# EAGLE design Plasma speaker (EAGLE 8.3.1)
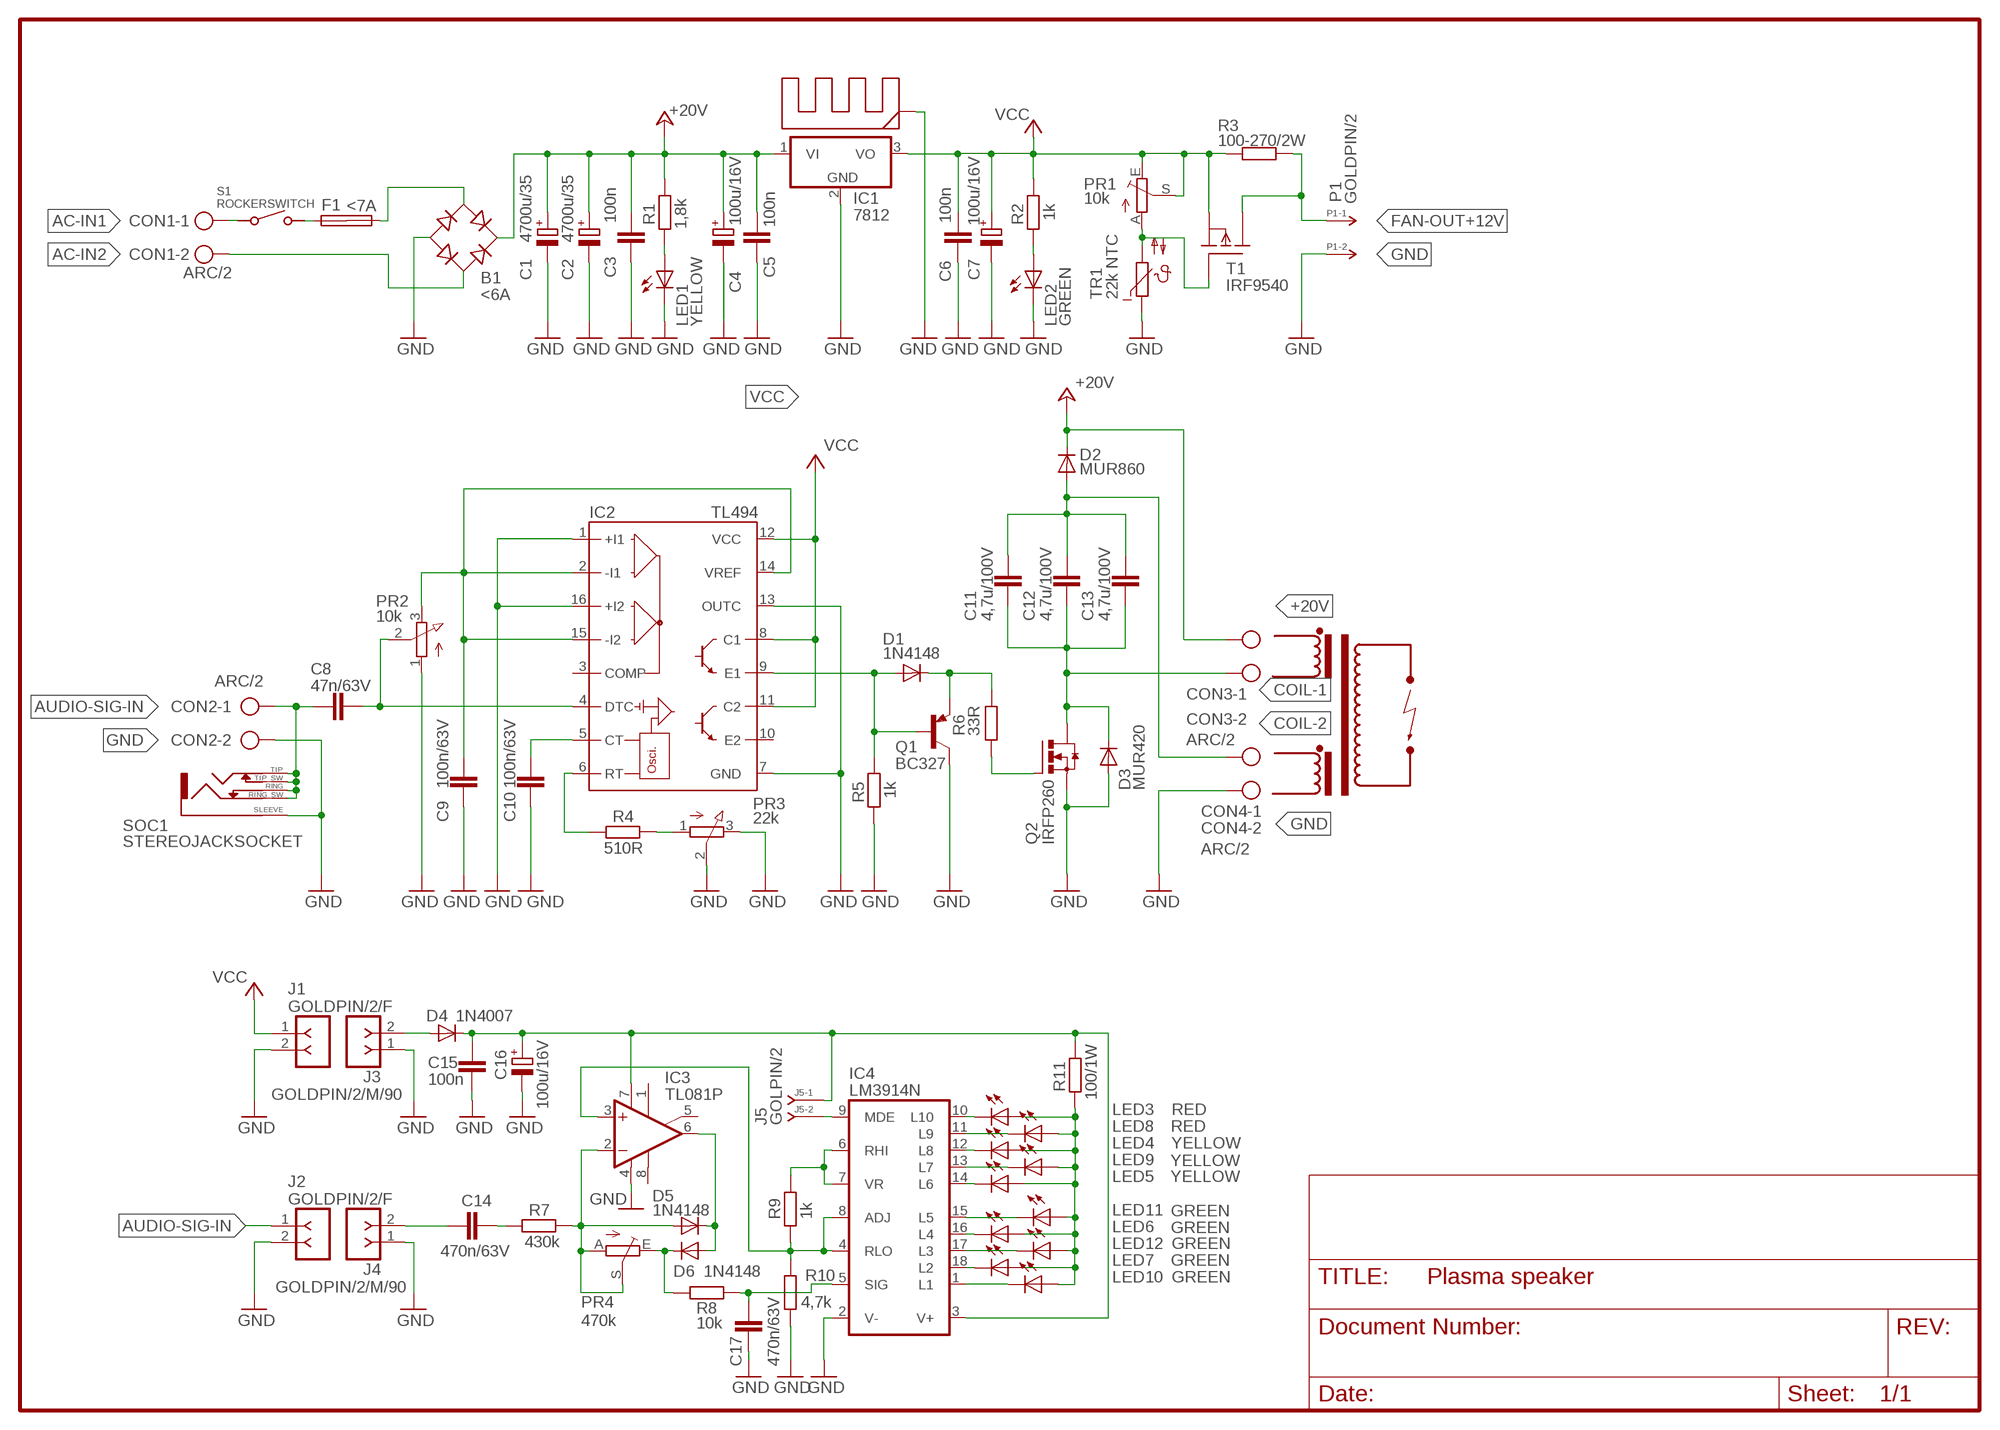
[diagram p0: schematic, sheet 1]

## Parts
B1  <6A  RECTIFIER-SKB32  [SKB32]
C1  4700u/35  CPOL-EUE7.5-18  [E7,5-18]
C2  4700u/35  CPOL-EUE7.5-18  [E7,5-18]
C3  100n  C-EU025-025X050  [C025-025X050]
C4  100u/16V  CPOL-EUE2.5-5  [E2,5-5]
C5  100n  C-EU025-025X050  [C025-025X050]
C6  100n  C-EU025-025X050  [C025-025X050]
C7  100u/16V  CPOL-EUE2.5-5  [E2,5-5]
C8  47n/63V  C-EU050-025X075  [C050-025X075]
C9  100n/63V  C-EU050-025X075  [C050-025X075]
C10  100n/63V  C-EU050-025X075  [C050-025X075]
C11  4,7u/100V  C-EU275-093X316  [C275-093X316]
C12  4,7u/100V  C-EU275-093X316  [C275-093X316]
C13  4,7u/100V  C-EU275-093X316  [C275-093X316]
C14  470n/63V  C-EU050-050X075  [C050-050X075]
C15  100n  C-EU025-025X050  [C025-025X050]
C16  100u/16V  CPOL-EUE2.5-5  [E2,5-5]
C17  470n/63V  C-EU050-050X075  [C050-050X075]
CON1  ARC/2  AK300/2  [AK300/2]
CON2  ARC/2  AK300/2  [AK300/2]
CON3  ARC/2  AK300/2  [AK300/2]
CON4  ARC/2  AK300/2  [AK300/2]
D1  1N4148  1N4148DO35-7  [DO35-7]
D2  MUR860  BYT08P  [TO220ACS]
D3  MUR420  BY203  [SGA-10]
D4  1N4007  1N4004  [DO41-10]
D5  1N4148  1N4148DO35-7  [DO35-7]
D6  1N4148  1N4148DO35-7  [DO35-7]
F1  <7A  SHK20L  [SHK20L]
IC1  7812  7812TV  [TO220V]
IC2  TL494  TL494CN  [DIL16]
IC3  TL081P  [DIL08]
IC4  LM3914N  [DIL18]
J1  GOLDPIN/2/F  F-1X02-SIP-100-40Y  [SIP-100-02-40Y]
J2  GOLDPIN/2/F  F-1X02-SIP-100-40Y  [SIP-100-02-40Y]
J3  GOLDPIN/2/M/90  F-1X02-KK-4455-A02  [KK-4455-A02]
J4  GOLDPIN/2/M/90  F-1X02-KK-4455-A02  [KK-4455-A02]
J5  GOLPIN/2  J-02-SIP-100-40Y  [SIP-100-02-40Y]
LED1  YELLOW  LED5MM  [LED5MM]
LED2  GREEN  LED5MM  [LED5MM]
LED3  RED  LED5MM  [LED5MM]
LED4  YELLOW  LED5MM  [LED5MM]
LED5  YELLOW  LED5MM  [LED5MM]
LED6  GREEN  LED5MM  [LED5MM]
LED7  GREEN  LED5MM  [LED5MM]
LED8  RED  LED5MM  [LED5MM]
LED9  YELLOW  LED5MM  [LED5MM]
LED10  GREEN  LED5MM  [LED5MM]
LED11  GREEN  LED5MM  [LED5MM]
LED12  GREEN  LED5MM  [LED5MM]
P1  GOLDPIN/2  P-02-SIP-100-40Y  [SIP-100-02-40Y]
PR1  10k  TRIM_EU-CA6V  [CA6V]
PR2  10k  3RP/1610N  [3RP/1610N]
PR3  22k  3RP/1610N  [3RP/1610N]
PR4  470k  TRIM_EU-CA6V  [CA6V]
Q1  BC327  BC327-25-PNP-TO92-EBC  [TO92-EBC]
Q2  IRFP260  IRFP240  [TO247BV]
R1  1,8k  R-EU_0204/7  [0204/7]
R2  1k  R-EU_0204/7  [0204/7]
R3  100-270/2W  R-EU_0309/12  [0309/12]
R4  510R  R-EU_0204/7  [0204/7]
R5  1k  R-EU_0204/7  [0204/7]
R6  33R  R-EU_0207/10  [0207/10]
R7  430k  R-EU_0204/7  [0204/7]
R8  10k  R-EU_0204/7  [0204/7]
R9  1k  R-EU_0204/7  [0204/7]
R10  4,7k  R-EU_0204/7  [0204/7]
R11  100/1W  R-EU_0411/15  [0411/15]
RAD1  TO3  RADIATOR-A  [RADIATOR]
S1  ROCKERSWITCH  [ROCKER]
SOC1  STEREOJACKSOCKET  PICAXE_STEREOJACKSOCKET  [PICAXE_STEREOJACKSOCKET]
T1  IRF9540  IRF9530  [TO220]
TR1  22k NTC  NTC640  [P640]

## Nets
+20V: B1.+ C1.+ C2.+ C3.1 C4.+ C5.1 CON3.1 D2.C IC1.1(VI) R1.1
AC-IN1: CON1.1 S1.IN1(IN) S1.IN2(IN)
AC-IN2: B1.AC2 CON1.2
AUDIO-SIG-IN: C8.2 CON2.1 J2.1 SOC1.RING SOC1.RING_SW(RING-SW) SOC1.TIP SOC1.TIP_SW(TIP-SW)
COIL-1: C11.2 C12.2 C13.2 CON3.2 D3.C Q2.D
COIL-2: C11.1 C12.1 C13.1 CON4.1 D2.A
FAN-OUT+12V: P1.1 R3.2 T1.2(D)
GND: B1.- C1.- C2.- C3.2 C4.- C5.2 C6.2 C7.- C9.2 C10.2 C15.2 C16.- C17.1 CON2.2 CON4.2 D3.A IC1.2(GND) IC2.1(+I1) IC2.7(GND) IC2.13(OUTC) IC2.16(+I2) IC3.4(V-) IC4.2(V-) J1.2 J2.2 J3.1 J4.1 LED1.K(C) LED2.K(C) P1.2 PR2.1(A) PR3.2(S) PR3.3(E) Q1.C Q2.S R5.1 R10.2 RAD1.GND SOC1.SLEEVE TR1.1
N$1: B1.AC1 F1.2A
N$2: C14.1 J4.2
N$3: C8.1 IC2.4(DTC) PR2.2(S)
N$4: Q2.G R6.1
N$5: PR1.A T1.1(G) TR1.2
N$6: D1.A IC2.9(E1) Q1.B R5.2
N$7: D4.A J3.2
N$8: IC4.10(L10) LED3.K(C)
N$9: C10.1 IC2.5(CT)
N$11: IC2.6(RT) R4.2
N$12: PR3.1(A) R4.1
N$13: D1.C Q1.E R6.2
N$15: F1.1A S1.OUT
N$16: LED2.A R2.2
N$18: LED1.A R1.2
N$19: C9.1 IC2.2(-I1) IC2.14(VREF) IC2.15(-I2) PR2.3(E)
N$20: IC4.11(L9) LED8.K(C)
N$21: IC4.12(L8) LED4.K(C)
N$22: IC4.13(L7) LED9.K(C)
N$23: IC4.14(L6) LED5.K(C)
N$24: IC4.1(L1) LED10.K(C)
N$25: IC4.18(L2) LED7.K(C)
N$26: IC4.17(L3) LED12.K(C)
N$27: IC4.16(L4) LED6.K(C)
N$28: IC4.15(L5) LED11.K(C)
N$29: LED3.A LED4.A LED5.A LED6.A LED7.A LED8.A LED9.A LED10.A LED11.A LED12.A R11.1
N$30: IC3.3(+IN) IC4.4(RLO) IC4.8(ADJ) R9.2 R10.1
N$31: D5.A IC3.2(-IN) PR4.A PR4.S R7.1
N$32: IC4.6(RHI) IC4.7(VR) R9.1
N$34: C14.2 R7.2
N$38: D5.C D6.A IC3.6(OUT)
N$39: IC4.9(MDE) J5.2
N$40: D6.C PR4.E R8.2
N$42: C17.2 IC4.5(SIG) R8.1
V+: C15.1 C16.+ D4.C IC3.7(V+) IC4.3(V+) J5.1 R11.2
VCC: C6.1 C7.+ IC1.3(VO) IC2.8(C1) IC2.11(C2) IC2.12(VCC) J1.1 PR1.E PR1.S R2.1 R3.1 T1.3(S)
Unconnected: F1.1B F1.2B IC2.3(COMP) IC2.10(E2) IC3.1(ON1) IC3.5(ON2) IC3.8(OPT)

## Library data of the parts
B1 = rectifier:RECTIFIER-: Rectifier
C1 C2 C4 C7 C16 = rcl:CPOL-EU: POLARIZED CAPACITOR, European symbol
C3 C5 C6 C8-C15 C17 = rcl:C-EU: CAPACITOR, European symbol
CON1-CON4 = con-ptr500:AK300/2: CONNECTOR; OC_FARNELL: unknown; OC_NEWARK: unknown
D1 D5 D6 = diode:1N4148: DIODE high speed (Philips)
D2 = diode:BYT08P: DIODE ultra fast
D3 = diode:BY203: DIODE Si, 2 kV, 0.25 A, 300 ns
D4 = diode:1N4004: DIODE general purpose rectifier, 1 A
F1 = fuse:SHK20L: FUSE HOLDER 5 x 20 mm, SH contact, SHH1 Schukat, E1073 Buerklin; OC_FARNELL: unknown; OC_NEWARK: unknown
IC1 = linear:78*: Positive VOLTAGE REGULATOR Source: http://cache.national.com/ds/LM/LM78L05.pdf http://www.fairchildsemi.com/ds/LM/LM7805.pdf
IC2 = linear:TL494*: SWITCHMODE Pulse Width Modulation Control Circuit NCV494B http://onsemi.com tl494-d.pdf
IC3 = linear:TL081: OP AMP
IC4 = linear:LM3914N: LED DRIVER senses analog voltage levels and drives 10 LEDs
J1-J4 = con-headers-jp:F-1X02-: FEMALE HEADER
J5 = con-headers-jp:J-02-: HEADER JACK PINS
LED1-LED12 = led:LED: LED OSRAM: - CHIPLED LG R971, LG N971, LY N971, LG Q971, LY Q971, LO R971, LY R971 LH N974, LH R974 LS Q976, LO Q976, LY Q976 LO Q996 - Hyper CHIPLED LW Q18S LB Q993, LB Q99A, LB R99A - SideLED LS A670, LO A670, LY A670, LG A670, LP A670 LB A673, LV A673, LT A673, LW A673 LH A674 LY A675 LS A676, LA A676, LO A676, LY A676, LW A676 LS A679, LY A679, LG A679 - Hyper Micro SIDELED® LS Y876, LA Y876, LO Y876, LY Y876 LT Y87S - SmartLED LW L88C, LW L88S LB L89C, LB L89S, LG L890 LS L89K, LO L89K, LY L89K LS L896, LA L896, LO L896, LY L896 - TOPLED LS T670, LO T670, LY T670, LG T670, LP T670 LSG T670, LSP T670, LSY T670, LOP T670, LYG T670 LG T671, LOG T671, LSG T671 LB T673, LV T673, LT T673, LW T673 LH T674 LS T676, LA T676, LO T676, LY T676, LB T676, LH T676, LSB T676, LW T676 LB T67C, LV T67C, LT T67C, LS T67K, LO T67K, LY T67K, LW E67C LS E67B, LA E67B, LO E67B, LY E67B, LB E67C, LV E67C, LT E67C LW T67C LS T679, LY T679, LG T679 LS T770, LO T770, LY T770, LG T770, LP T770 LB T773, LV T773, LT T773, LW T773 LH T774 LS E675, LA E675, LY E675, LS T675 LS T776, LA T776, LO T776, LY T776, LB T776 LHGB T686 LT T68C, LB T68C - Hyper Mini TOPLED® LB M676 - Mini TOPLED Santana® LG M470 LS M47K, LO M47K, LY M47K Source: http://www.osram.convergy.de LUXEON: - LUMILED® LXK2-PW12-R00, LXK2-PW12-S00, LXK2-PW14-U00, LXK2-PW14-V00 LXK2-PM12-R00, LXK2-PM12-S00, LXK2-PM14-U00 LXK2-PE12-Q00, LXK2-PE12-R00, LXK2-PE12-S00, LXK2-PE14-T00, LXK2-PE14-U00 LXK2-PB12-K00, LXK2-PB12-L00, LXK2-PB12-M00, LXK2-PB14-N00, LXK2-PB14-P00, LXK2-PB14-Q00 LXK2-PR12-L00, LXK2-PR12-M00, LXK2-PR14-Q00, LXK2-PR14-R00 LXK2-PD12-Q00, LXK2-PD12-R00, LXK2-PD12-S00 LXK2-PH12-R00, LXK2-PH12-S00 LXK2-PL12-P00, LXK2-PL12-Q00, LXK2-PL12-R00 Source: www.luxeon.com KINGBRIGHT: KA-3528ASYC Source: www.kingbright.com
P1 = con-headers-jp:P-02-: HEADER PLUG PINS
PR1 PR4 = pot:TRIM_EU-: POTENTIOMETER
PR2 PR3 = pot:3RP/1610N: 16mm Potentiometer one level Source: http://www.alphapotentiometers.net/html/16mm_pot_2.html
Q1 = transistor:*-PNP-: PNP Transistror
Q2 = transistor-power:IRFP240: HEXFET Power MosFet Source: http://www.irf.com/
R1-R11 = rcl:R-EU_: RESISTOR, European symbol
RAD1 = M-SOUND:RADIATOR
S1 = Rocker Switch:ROCKERSWITCH
SOC1 = PICAXE_StereoJackSocket:PICAXE_STEREOJACKSOCKET
T1 = transistor-fet:IRF9530: P-Channel Enhancement MOSFET (HEXFET); -100V; -12A; 0,3Ohm
TR1 = ptc-ntc:NTC640: PHILIPS NTC; OC_FARNELL: unknown; OC_NEWARK: unknown

## Board
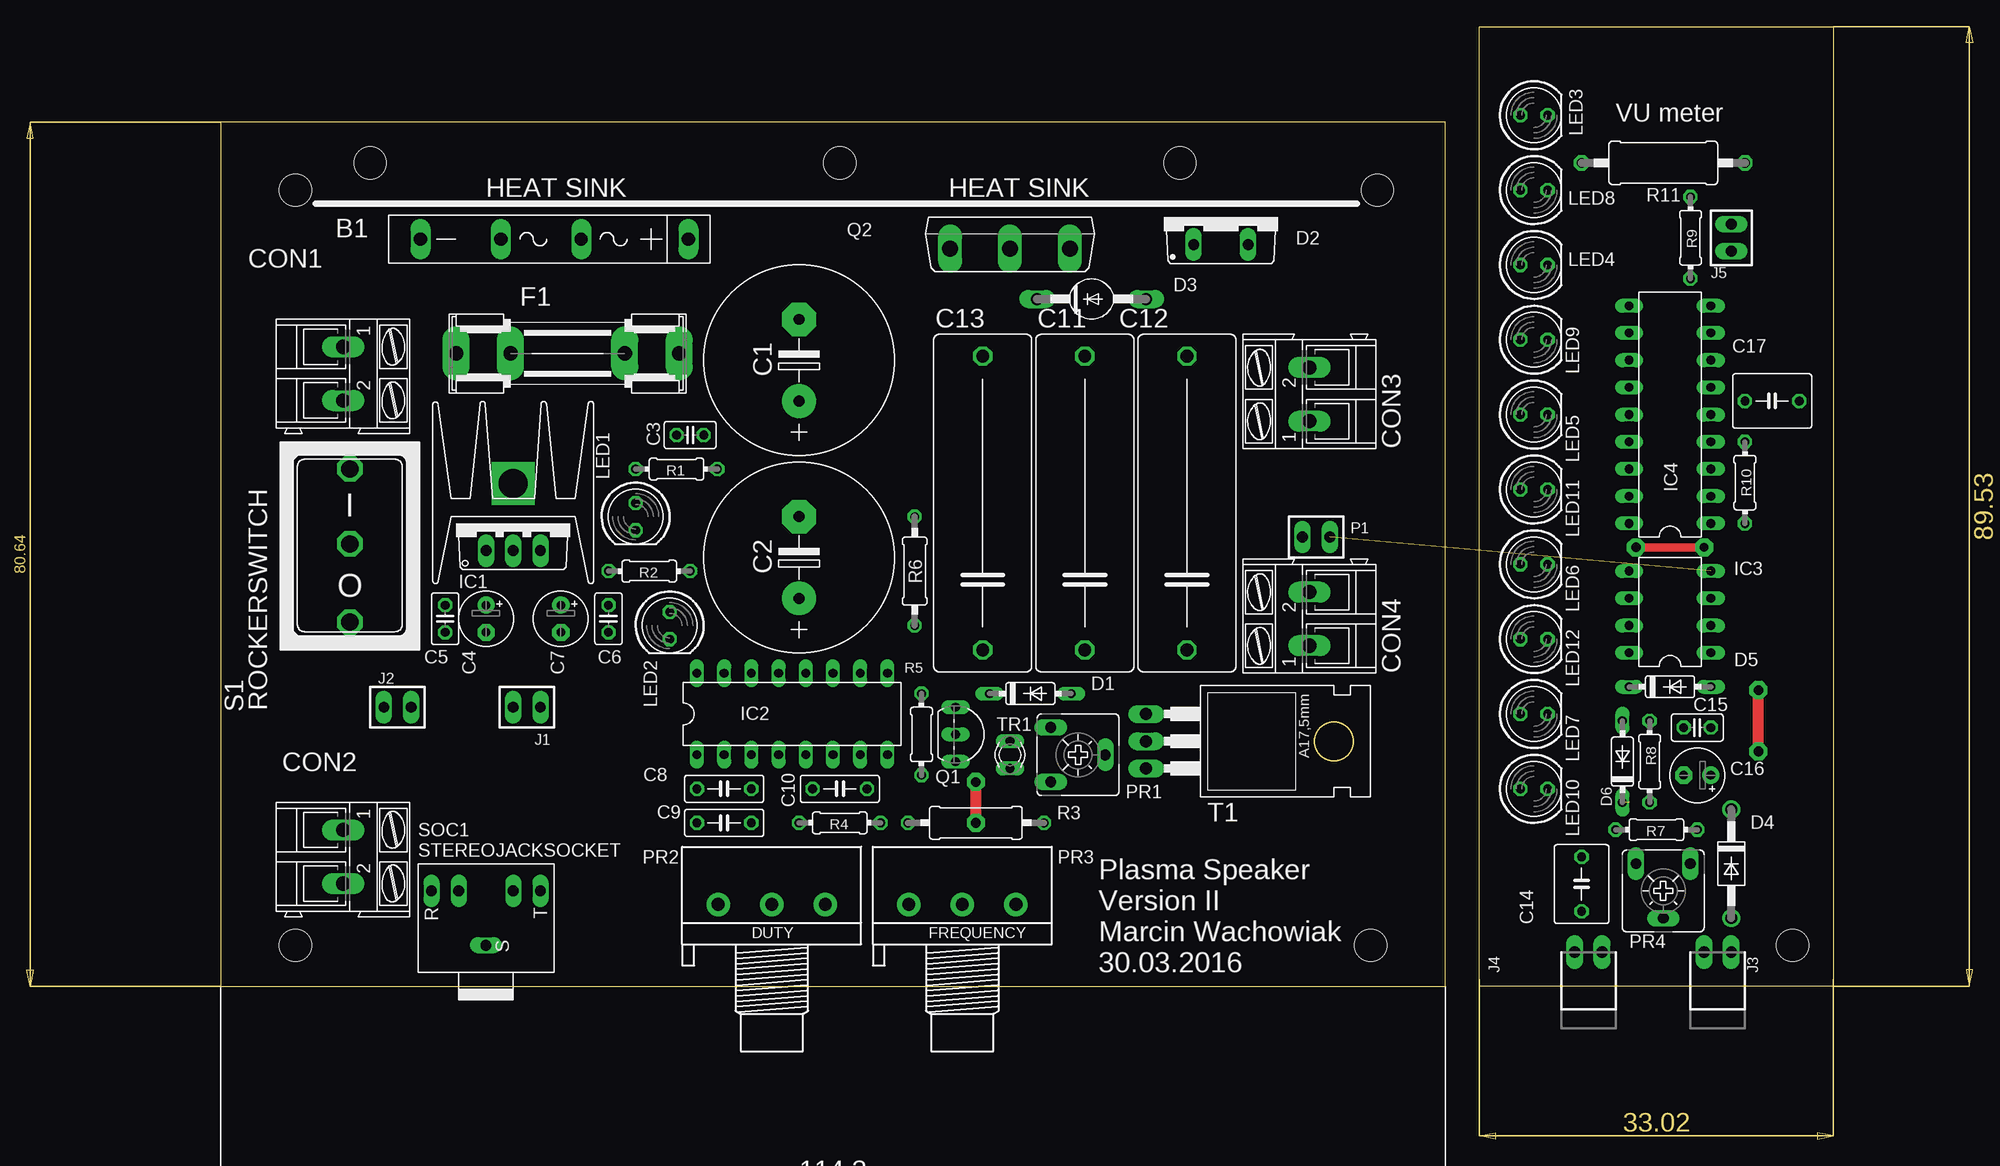
[diagram p1: board, top side]
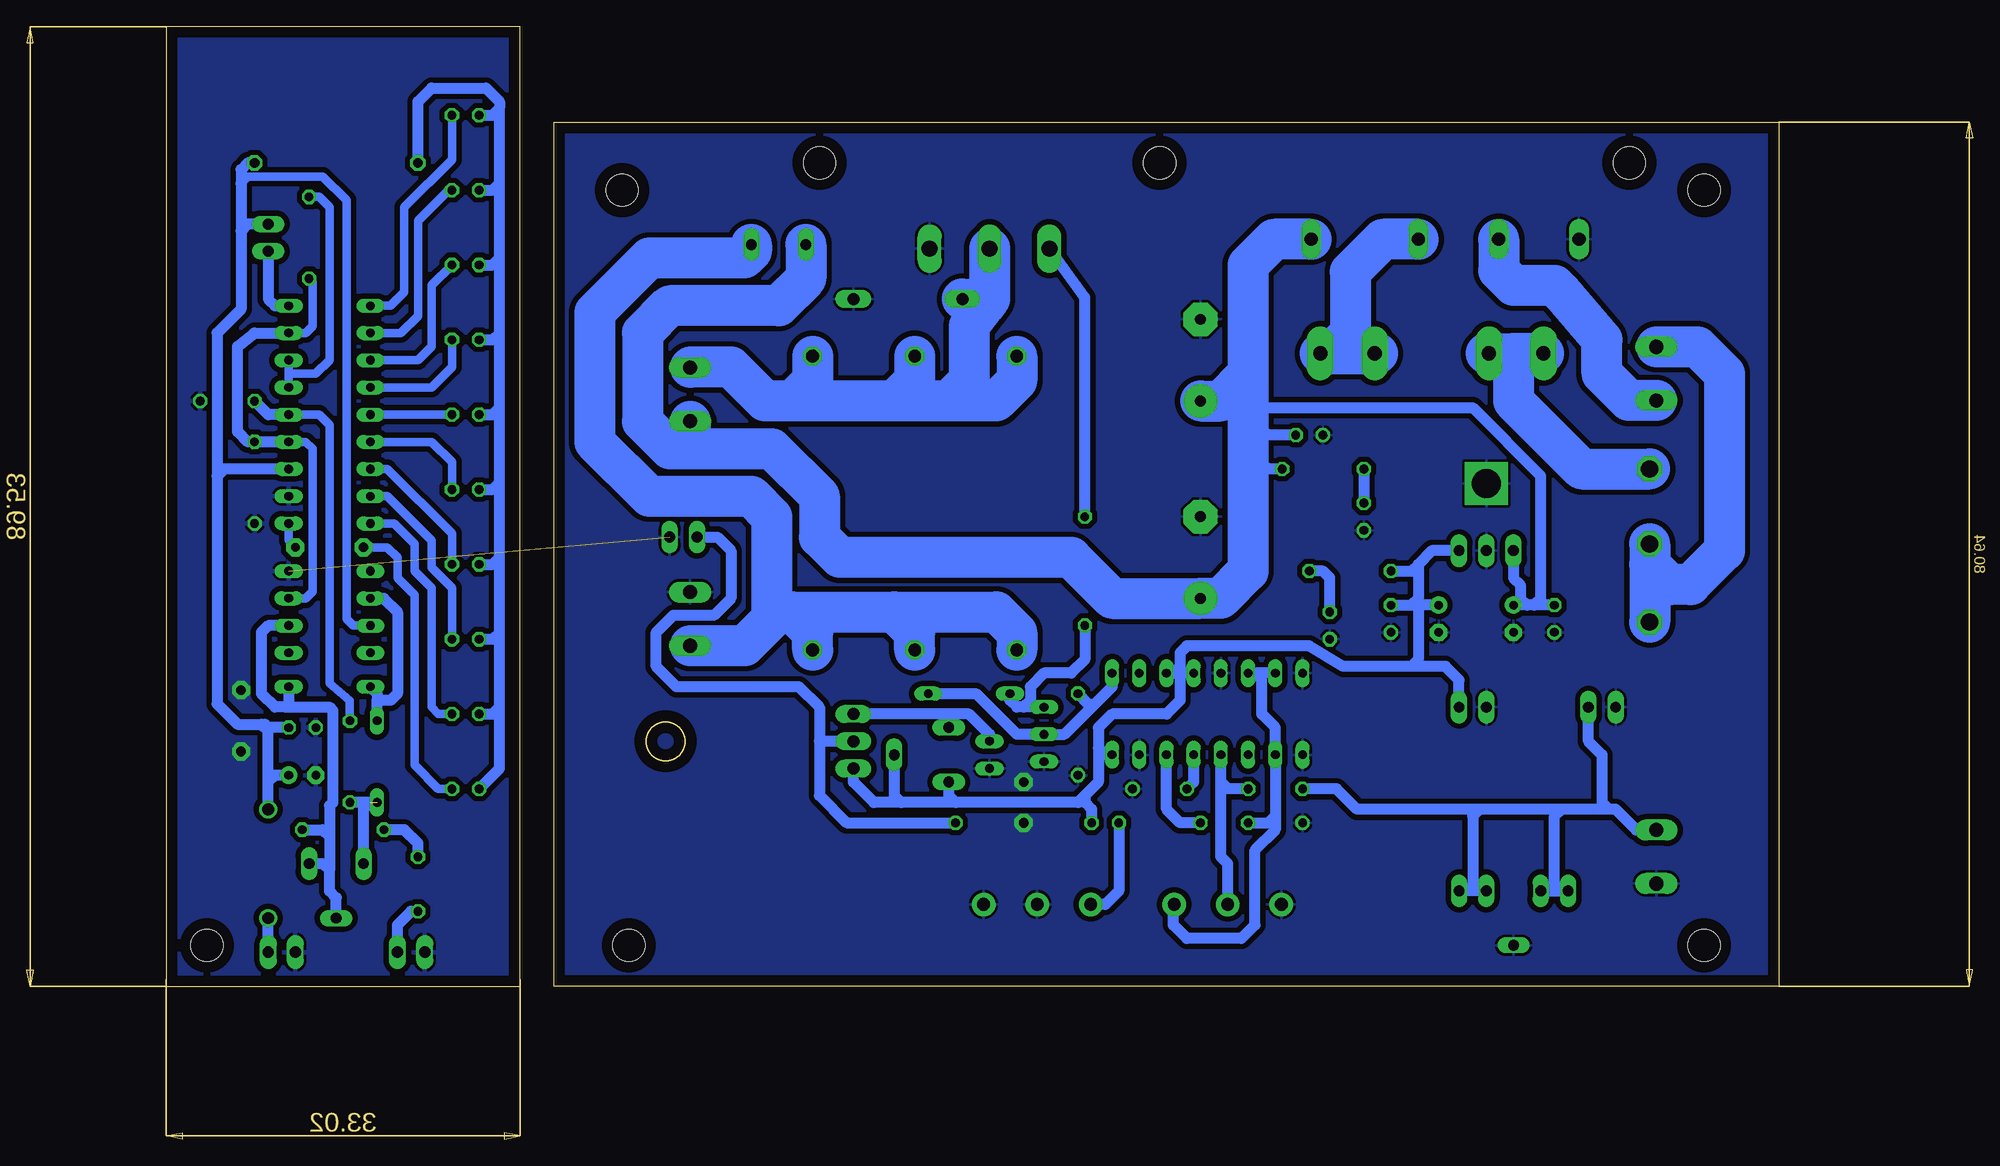
[diagram p2: board, bottom side, seen from below]

Size 150.5 x 89.53 mm. Coordinates in mm from the lower left corner, seen from the top.
Outline: 0,0 114.28,0 114.28,80.63 0,80.63 0,0
Outline: 117.47,89.53 150.5,89.53 150.5,0 117.47,0 117.47,89.53
Copper layers (1*16): Top 0.035mm / dielectric 1.5mm / Bottom 0.035mm
Design rules "default": minimum track width 10mil, minimum drill 24mil, track to track 8mil, track to pad 8mil, pad to pad 8mil, via to via 8mil, smd to smd 8mil, copper to edge 40mil, drill to drill 8mil, minimum pad ring 10mil, minimum via ring 8mil, stop-mask expansion 4mil, vias tented up to drill 0mil, thermal gap 10mil
Holes 3 mm at 6.99,74.3 107.95,74.3 6.99,3.81 107.31,3.81 13.97,76.83 57.78,76.83 89.53,76.83 146.69,3.81

### Footprints (pad centres in the part's own frame; a part is rotated, then mirrored left to right if it is on the bottom)
SKB32 = drill 1.25 long: + -23.97,-0.5; - 1.024,-0.5; AC1 -13.962,-0.5; AC2 -6.469,-0.5
E7,5-18 = drill 1.016 pad 3.15: + -3.81,0 | drill 1.016 pad 3.15 octagon: - 3.81,0
C025-025X050 = drill 0.813 octagon: 1 -1.27,0; 2 1.27,0
E2,5-5 = drill 0.813 pad 1.6: + -1.27,0 | drill 0.813 pad 1.6 octagon: - 1.27,0
C050-025X075 = drill 0.813 octagon: 1 -2.54,0; 2 2.54,0
C275-093X316 = drill 1.194 octagon: 1 -13.716,0; 2 13.716,0
C050-050X075 = drill 0.813 octagon: 1 -2.54,0; 2 2.54,0
AK300/2 = drill 1.321 long: 1 -2.515,0; 2 2.489,0
DO35-7 = drill 0.813 long: A 3.81,0; C -3.81,0
TO220ACS = drill 1.016 long: A 2.54,-2.54; C -2.54,-2.54
SGA-10 = drill 1.118 long: A 5.08,0; C -5.08,0
DO41-10 = drill 1.118: A 5.08,0; C -5.08,0
SHK20L = drill 1.321 pad 2.54 long: 1A -10.414,0; 1B -5.334,0; 2A 10.414,0; 2B 5.334,0
TO220V = drill 1.016 long: 1 -2.54,-2.54; 2 0,-2.54; 3 2.54,-2.54
DIL16 = drill 0.813 long: 1 -8.89,-3.81; 2 -6.35,-3.81; 3 -3.81,-3.81; 4 -1.27,-3.81; 5 1.27,-3.81; 6 3.81,-3.81; 7 6.35,-3.81; 8 8.89,-3.81; 9 8.89,3.81; 10 6.35,3.81; 11 3.81,3.81; 12 1.27,3.81; 13 -1.27,3.81; 14 -3.81,3.81; 15 -6.35,3.81; 16 -8.89,3.81
DIL08 = drill 0.813 pad 1.27 long: 1 -3.81,-3.81; 2 -1.27,-3.81; 3 1.27,-3.81; 4 3.81,-3.81; 5 3.81,3.81; 6 1.27,3.81; 7 -1.27,3.81; 8 -3.81,3.81
DIL18 = drill 0.813 long: 1 -10.16,-3.81; 2 -7.62,-3.81; 3 -5.08,-3.81; 4 -2.54,-3.81; 5 0,-3.81; 6 2.54,-3.81; 7 5.08,-3.81; 8 7.62,-3.81; 9 10.16,-3.81; 10 10.16,3.81; 11 7.62,3.81; 12 5.08,3.81; 13 2.54,3.81; 14 0,3.81; 15 -2.54,3.81; 16 -5.08,3.81; 17 -7.62,3.81; 18 -10.16,3.81
SIP-100-02-40Y = drill 1.016 long: 1 -1.27,0; 2 1.27,0
KK-4455-A02 = drill 1.067 long: 1 -1.27,0; 2 1.27,0
LED5MM = drill 0.813 octagon: A -1.27,0; K 1.27,0
CA6V = drill 1.016 long: A -2.54,-2.54; E 2.54,-2.54; S 0,2.54
3RP/1610N = drill 1.2 pad 2.184: 1 -5,0; 2 0,0; 3 5,0
TO92-EBC = drill 0.813 long: B 0,-1.27; C 2.54,-1.27; E -2.54,-1.27
TO247BV = drill 1.499 long: D 0,-2.921; G -5.588,-2.921; S 5.588,-2.921
0204/7 = drill 0.813 octagon: 1 -3.81,0; 2 3.81,0
0309/12 = drill 0.813 octagon: 1 -6.35,0; 2 6.35,0
0207/10 = drill 0.813 octagon: 1 -5.08,0; 2 5.08,0
0411/15 = drill 0.914 octagon: 1 -7.62,0; 2 7.62,0
RADIATOR = drill 2.7 pad 4 square: GND 3.1,0
ROCKER = drill 1.6 octagon: IN1 0,7.3; IN2 0,0; OUT 0,-7
PICAXE_STEREOJACKSOCKET = drill 1 long: RING -5.08,-5.08; RING_SW -5.08,-2.54; SLEEVE 0,0; TIP -5.08,5.08; TIP_SW -5.08,2.54
TO220 = drill 1.118 long: 1 -2.54,-6.35; 2 0,-6.35; 3 2.54,-6.35
P640 = drill 0.813 long: 1 -1.27,0; 2 1.27,0

### Placement (x,y rotation side)
B1  19.68,69.22 180 top
C1  53.98,58.42 90 top
C2  53.98,40.01 90 top
C3  43.81,51.44 180 top
C4  24.77,34.29 270 top
C5  20.95,34.29 270 top
C6  36.2,34.29 270 top
C7  31.75,34.29 270 top
C8  46.99,18.41 180 top
C9  46.99,15.24 180 top
C10  57.78,18.41 0 top
C11  80.64,45.09 90 top
C12  90.17,45.09 90 top
C13  71.12,45.09 90 top
C14  127,9.53 90 top
C15  137.79,24.13 180 top
C16  137.79,19.68 180 top
C17  144.78,54.61 180 top
CON1  11.43,57.15 270 top
CON2  11.43,12.06 270 top
CON3  101.6,55.24 90 top
CON4  101.6,34.29 90 top
D1  75.56,27.3 0 top
D2  93.34,71.75 0 top
D3  81.28,64.14 0 top
D4  140.97,11.43 270 top
D5  135.25,27.94 0 top
D6  130.81,20.95 90 top
F1  32.38,59.05 0 top
IC1  27.3,43.18 0 top
IC2  53.34,25.4 0 top
IC3  135.25,34.92 90 top
IC4  135.25,53.34 90 top
J1  28.57,26.04 180 top
J2  16.51,26.04 180 top
J3  139.7,3.17 0 top
J4  127.64,3.17 0 top
J5  140.97,69.85 270 top
LED1  38.73,43.81 270 top
LED2  41.91,33.66 270 top
LED3  122.56,81.28 0 top
LED4  122.56,67.31 0 top
LED5  122.56,53.34 0 top
LED6  122.56,39.37 0 top
LED7  122.56,25.4 0 top
LED8  122.56,74.3 0 top
LED9  122.56,60.33 0 top
LED10  122.56,18.41 0 top
LED11  122.56,46.35 0 top
LED12  122.56,32.38 0 top
P1  102.23,41.91 0 top
PR1  80.01,21.59 270 top
PR2  51.44,7.62 0 top
PR3  69.22,7.62 0 top
PR4  134.62,8.89 180 top
Q1  69.85,23.5 270 top
Q2  73.66,71.75 0 top
R1  42.55,48.26 180 top
R2  40.01,38.73 0 top
R3  70.48,15.24 0 top
R4  57.78,15.24 180 top
R5  65.41,23.5 90 top
R6  64.77,38.73 270 top
R7  133.99,14.61 180 top
R8  133.35,20.95 270 top
R9  137.16,69.85 270 top
R10  142.24,46.99 270 top
R11  134.62,76.83 0 top
RAD1  27.3,43.81 90 top
S1  12.06,41.27 180 top
SOC1  24.77,3.81 270 top
T1  92.71,22.86 270 top
TR1  73.66,21.59 90 top

### Tracks (layer width: path | path; a pad name or v marks a point on that pad's centre or on a via)
+20V
  Bottom 1.016: C3.1 47.62,51.44 48.26,52.07 48.9,51.44 49.53,51.44 | 49.53,48.9 48.26,48.9 47.62,48.26 R1.1 48.26,48.26 48.26,53.98 28.57,53.98 22.23,47.62 22.23,36.2 22.86,35.56 | C5.1 22.86,35.56 | 22.86,35.56 23.5,35.56 | 23.5,35.56 C4.+ | IC1.1 24.77,38.1 24.13,37.47 24.13,36.2 23.5,35.56
  Bottom 3.81: B1.+ 47.12,69.72 49.53,67.31 49.53,57.15 | 49.53,57.15 49.53,51.44 49.53,48.9 49.53,38.73 52.07,36.2 C2.+ 62.23,36.2 66.04,40.01 87.63,40.01 89.53,41.91 89.53,45.72 93.98,50.16 101.6,50.16 | C1.+ 52.07,54.61 49.53,57.15 | 101.6,50.16 103.5,50.16 106.05,52.7 106.05,60.96 103.5,63.5 93.34,63.5 90.81,66.04 D2.C | CON3.1 101.6,50.16
AC-IN1
  Bottom 3.81: CON1.1 7.59,59.66 5.08,57.15 5.08,40.64 8.26,37.47 10.16,37.47 12.06,39.37 | S1.IN2 12.06,39.37 | 12.06,39.37 S1.IN1
AC-IN2
  Bottom 3.81: CON1.2 14.02,54.66 16.51,57.15 16.51,60.33 20.32,64.77 20.95,65.41 24.77,65.41 26.15,66.79 B1.AC2
AUDIO-SIG-IN
  Bottom 1.016: 15.88,16.51 15.24,16.51 13.31,14.58 CON2.1 | 15.88,16.51 20.32,16.51 | 20.32,16.51 27.94,16.51 | C8.2 41.27,18.41 39.37,16.51 27.94,16.51 | 20.32,16.51 20.95,15.88 20.95,9.53 20.32,8.89 SOC1.RING SOC1.RING_SW | 27.94,16.51 28.57,15.88 28.57,9.53 27.94,8.89 | 15.88,16.51 16.51,17.14 16.51,21.59 17.78,22.86 J2.1 | SOC1.TIP_SW 27.94,8.89 | 27.94,8.89 SOC1.TIP
COIL-1
  Bottom 3.81: C13.2 71.12,56.52 73.03,54.61 76.2,54.61 | CON3.2 101.55,57.78 97.79,57.78 94.61,54.61 92.08,54.61 | C12.2 90.17,56.52 92.08,54.61 | 76.2,54.61 76.83,54.61 | 76.83,54.61 82.55,54.61 | 82.55,54.61 92.08,54.61 | C11.2 80.64,56.52 82.55,54.61 | Q2.D 73.66,64.14 74.19,63.42 | 74.19,63.42 75.56,61.59 75.56,56.52 76.83,55.24 76.83,54.61 | 75.56,55.24 76.2,54.61 | D3.C 74.93,64.14 74.22,63.42 74.19,63.42
COIL-2
  Bottom 1.016: 110.49,62.87 110.49,63.5
  Bottom 3.81: CON4.1 96.5,31.77 93.66,34.61 | 92.08,34.92 93.34,34.92 93.66,34.61 | 92.08,34.92 82.55,34.92 | C11.1 80.64,33.02 82.55,34.92 | C12.1 90.17,33.02 92.08,34.92 | 82.55,34.92 73.03,34.92 71.12,33.02 C13.1 | 93.66,34.61 93.98,34.92 93.98,43.81 95.89,45.72 105.41,45.72 110.49,50.8 110.49,62.87 105.41,67.94 96.52,67.94 95.89,68.58 D2.A
FAN-OUT+12V
  Bottom 1.016: 89.53,22.86 89.53,26.04 91.44,27.94 102.87,27.94 104.78,29.84 104.78,33.02 103.19,34.61 99.38,34.61 97.79,36.2 97.79,40.64 99.06,41.91 P1.1 | 89.53,22.86 89.53,17.78 87,15.24 R3.2 | T1.2 89.53,22.86
GND  (via drill 0.9 pad 1.68)  (1 unrouted)
  Top 1.016: v70.48,15.24 v70.48,19.05 | v143.51,21.91 v143.51,27.62
  pour Bottom (isolate 0.5): 117.47,89.53 117.47,0 150.5,0 150.5,89.53
  pour Bottom (isolate 0.5): 0,80.64 0,0 114.3,0 114.3,80.64
N$1
  Bottom 3.81: F1.2A 41.91,59.05 | 41.91,59.05 37.47,59.05 | B1.AC1 36.97,69.72 40.01,66.67 40.01,60.96 41.91,59.05
N$2
  Bottom 1.016: J4.2 128.91,5.71 127.64,6.99 C14.1
N$3
  Bottom 1.016: C8.1 51.44,18.41 52.07,19.05 | 52.07,19.05 IC2.4 | PR2.2 51.44,11.43 52.07,12.06 52.07,19.05
N$4
  Bottom 1.016: R6.1 64.77,64.26 Q2.G
N$5
  Bottom 1.016: TR1.2 73.66,23.5 75.56,25.4 78.11,25.4 | 78.11,25.4 T1.1 | PR1.A 77.47,24.77 78.11,25.4
N$6
  Bottom 1.016: IC2.9 62.23,27.94 63.82,26.35 | 63.82,26.35 66.67,23.5 Q1.B 71.12,23.5 74.93,27.3 D1.A | R5.2 64.45,26.35 63.82,26.35
N$7
  Bottom 1.016: J3.2 D4.A
N$8
  Bottom 0.813: LED3.K 123.83,77.15 128.27,72.71 128.27,64.77 129.54,63.5 IC4.10
N$9
  Bottom 1.016: IC2.5 54.61,19.05 C10.1
N$11
  Bottom 1.016: R4.2 55.88,15.24 57.15,16.51 IC2.6
N$12
  Bottom 1.016: R4.1 61.59,8.89 62.87,7.62 PR3.1
N$13
  Bottom 1.016: R6.2 64.77,30.48 66.04,29.21 68.58,29.21 69.85,27.94 69.85,26.67 70.48,26.04 | Q1.E 70.48,26.04 | 70.48,26.04 71.12,26.04 71.75,26.67 D1.C
N$15
  Bottom 3.81: F1.1A 24.77,59.05 | 27.3,59.05 24.77,59.05 | 24.77,59.05 24.77,54.61 18.41,48.26 12.08,48.26 S1.OUT
N$16
  Bottom 1.016: LED2.A 41.91,38.1 42.55,38.73 R2.2
N$18
  Bottom 1.016: R1.2 LED1.A
N$19
  Bottom 1.016: IC2.15 48.9,29.21 | 48.9,29.21 IC2.14 | 48.9,29.21 48.26,28.57 48.26,25.4 46.99,24.13 IC2.2 46.99,15.88 | PR2.3 56.52,7.54 56.52,5.71 55.24,4.45 50.16,4.45 48.9,5.71 48.9,12.7 46.99,14.61 46.99,15.88 | C9.1 47.62,15.24 46.99,15.88
N$20
  Bottom 0.813: LED8.K 124.14,74.3 127,71.44 127,62.55 128.59,60.96 IC4.11
N$21
  Bottom 0.813: IC4.12 127,58.42 125.73,59.69 125.73,65.41 LED4.K
N$22
  Bottom 0.813: IC4.13 125.73,55.88 123.83,57.78 LED9.K
N$23
  Bottom 0.813: LED5.K IC4.14
N$24  (via drill 0.8 pad 1.68, 0.9 pad 1.68)
  Top 0.813: v138.43,40.96 v132.08,40.96
  Bottom 0.813: IC4.1 139.06,41.59 v138.43,40.96 | LED10.K 125.09,18.41 127.32,20.64 127.32,36.51 128.91,38.1 128.91,40.01 129.86,40.96 v132.08,40.96
N$25
  Bottom 0.813: LED7.K 125.09,25.4 125.73,26.04 125.73,37.15 127.32,38.73 127.32,41.27 129.22,43.18 IC4.18
N$26
  Bottom 0.813: LED12.K 123.83,37.15 125.73,39.05 125.73,41.59 129.86,45.72 IC4.17 130.49,45.72
N$27
  Bottom 0.813: LED6.K 123.83,42.23 129.86,48.26 IC4.16
N$28
  Bottom 0.813: LED11.K 123.83,48.9 125.73,50.8 IC4.15
N$29
  Bottom 1.016: LED10.A 119.38,20.32 119.38,26.04 | 119.38,26.04 119.38,33.02 | 119.38,33.02 119.38,40.01 | 119.38,40.01 119.38,46.99 | 119.38,46.99 119.38,53.98 | 119.38,53.98 119.38,60.96 | 119.38,60.96 119.38,67.94 | 119.38,67.94 119.38,74.93 | 119.38,74.93 119.38,81.92 | LED3.A 120.02,81.28 119.38,81.92 | LED8.A 120.02,74.3 119.38,74.93 | LED4.A 120.02,67.31 119.38,67.94 | LED9.A 120.02,60.33 119.38,60.96 | LED5.A 120.02,53.34 119.38,53.98 | LED11.A 120.02,46.35 119.38,46.99 | LED6.A 120.02,39.37 119.38,40.01 | LED12.A 120.02,32.38 119.38,33.02 | LED7.A 120.02,25.4 119.38,26.04 | R11.1 127,82.55 125.73,83.82 120.65,83.82 119.38,82.55 119.38,81.92
N$30
  Bottom 0.813: IC4.8 137.48,60.96 136.84,61.59 136.84,65.72 R9.2 | 138.43,50.8 137.48,50.8 136.84,50.16 136.84,36.83 137.48,36.2 IC3.3 | IC4.4 142.88,50.8
  Bottom 1.016: IC3.3 138.43,36.2 | 138.43,50.8 IC4.4 R10.1 | 142.88,50.8 143.83,51.75 143.83,59.69 142.24,60.96 IC4.8
N$31
  Bottom 1.016: PR4.S 134.62,8.26 135.25,8.89 135.25,10.79 | 135.25,10.79 135.89,11.43 PR4.A | 135.25,13.97 135.25,10.79 | R7.1 135.89,14.61 135.25,13.97 | IC3.2 140.97,33.66 141.6,33.02 141.6,27.3 140.34,26.04 139.38,26.04 | D5.A 139.06,26.35 139.38,26.04 | 139.38,26.04 135.25,26.04 134.94,25.72 134.94,17.14 135.25,16.83 135.25,13.97
N$32
  Bottom 0.813: 139.06,57.15 IC4.6 | IC4.7 139.06,57.15 | R9.1 136.21,73.66 135.25,72.71 135.25,58.42 136.53,57.15 139.06,57.15
N$34
  Bottom 1.016: C14.2 127,13.34 128.27,14.61 R7.2
N$38
  Bottom 1.016: IC3.6 130.18,36.2 128.91,34.92 128.91,27.3 129.54,26.67 130.81,26.67 | D6.A 130.81,26.67 | D5.C 130.81,27.3 130.81,26.67
N$39
  Bottom 1.016: J5.2 140.97,64.14 140.34,63.5 IC4.9
N$40  (1 unrouted)
  Bottom 1.016: PR4.E 132.08,16.51 131.44,17.14 | D6.C R8.2
N$42
  Bottom 0.813: R8.1 133.35,26.67 135.25,28.26 135.25,52.39 136.21,53.34 IC4.5
  Bottom 1.016: IC4.5 140.97,53.34 C17.2
V+
  Bottom 0.813: IC3.7 133.03,33.66 133.67,34.29 133.67,73.34 135.89,75.56 142.88,75.56 143.51,74.93
  Bottom 1.016: D4.C 140.97,19.05 | C16.+ 140.34,19.68 140.97,19.05 | R11.2 142.88,76.83 143.51,76.2 143.51,74.93 143.51,70.48 | J5.1 142.88,71.12 143.51,70.48 | 145.73,47.62 145.73,60.96 143.51,63.18 143.51,70.48 | 145.73,47.62 145.73,26.35 143.83,24.45 141.6,24.45 140.97,23.81 | IC4.3 145.1,48.26 145.73,47.62 | 140.97,19.05 140.97,23.81 | 140.97,23.81 140.97,24.13 | C15.1 140.97,24.13 | 140.97,24.13 141.29,24.45
VCC
  Bottom 1.016: IC1.3 32.38,40.64 33.66,39.37 | 33.66,39.37 33.66,36.2 34.29,35.56 | C7.+ 33.66,35.56 | 33.66,35.56 34.29,35.56 | R2.1 34.29,38.73 33.66,39.37 | C6.1 34.29,35.56 | 34.29,29.84 40.64,29.84 43.81,31.75 55.24,31.75 55.88,31.11 55.88,29.84 56.52,29.21 | IC2.12 55.88,29.21 | 55.88,29.21 56.52,29.21 | IC2.11 56.52,29.21 | 55.88,29.21 55.88,26.67 57.15,25.4 62.23,25.4 63.5,24.13 63.5,22.23 | 63.5,22.23 63.5,19.05 64.77,17.78 | 76.83,17.14 65.41,17.14 64.77,17.78 | 76.83,17.14 81.92,17.14 | 81.92,17.14 84.45,17.14 86.36,19.05 T1.3 | IC2.8 62.87,21.59 63.5,22.23 | 64.77,17.78 64.77,17.14 64.14,16.51 R3.1 | PR1.E 77.47,17.78 76.83,17.14 | PR1.S 82.55,17.78 81.92,17.14 | 33.66,35.56 33.66,30.48 34.29,29.84 | J1.1 29.84,28.57 31.11,29.84 34.29,29.84

### Text on the board
tPlace: HEAT SINK | HEAT SINK
tNames: VU meter | DUTY | FREQUENCY | Plasma Speaker / Version II / Marcin Wachowiak / 30.03.2016